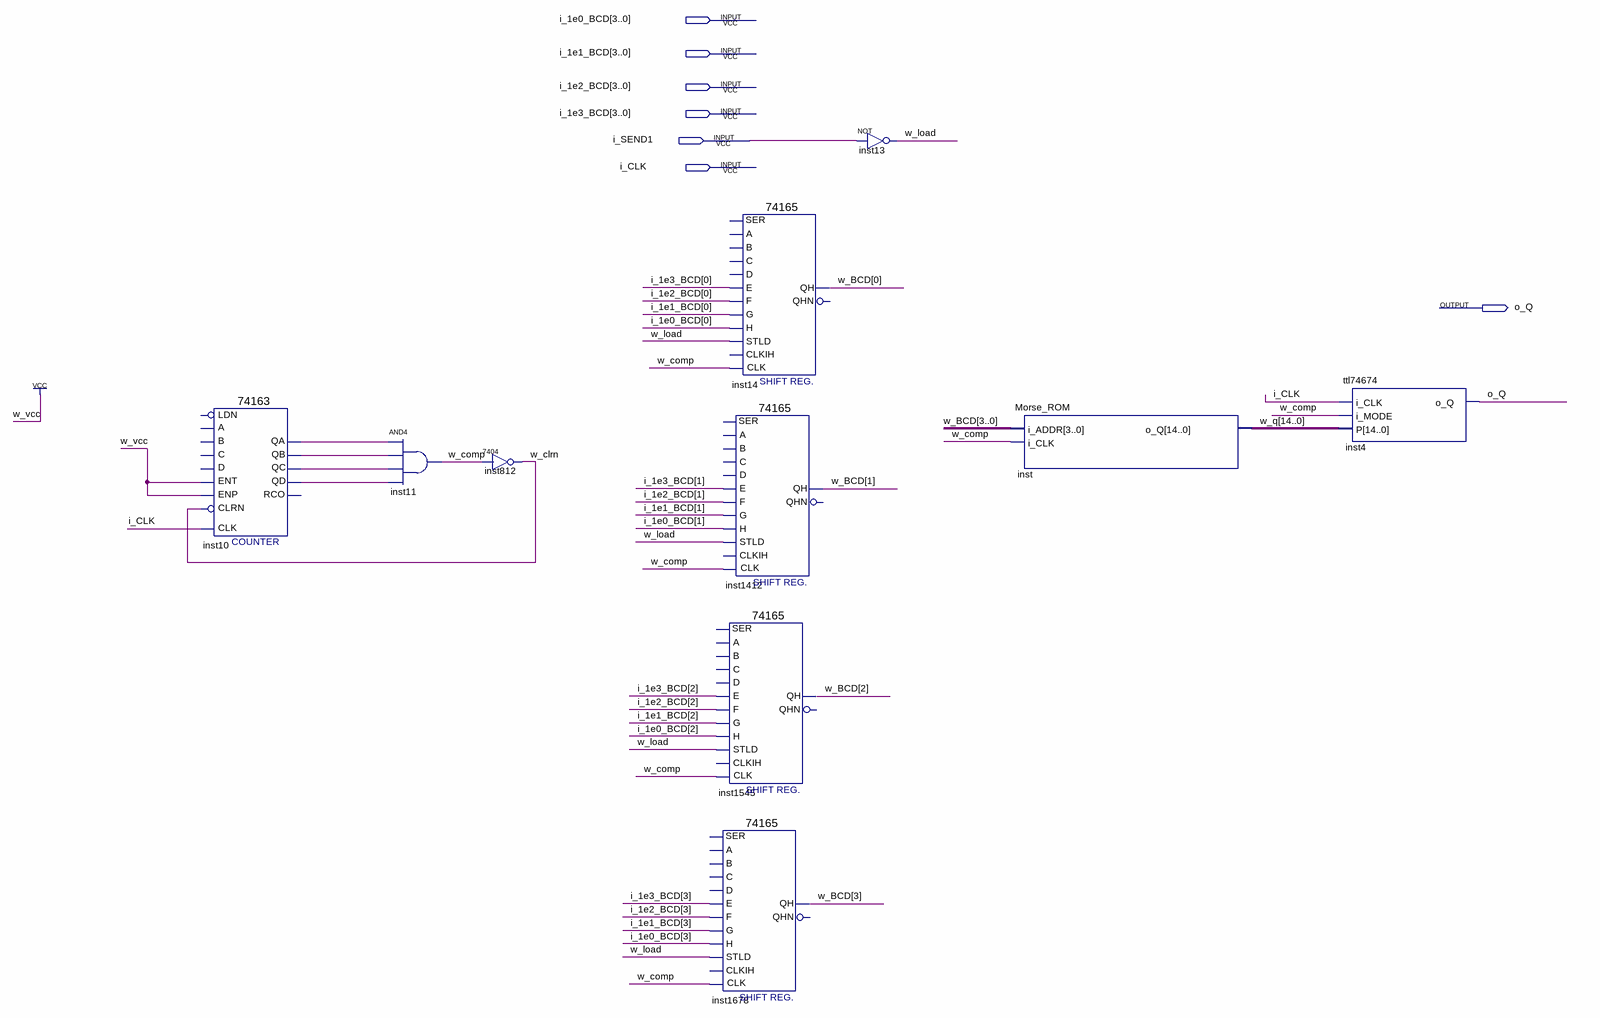
[diagram p0: schematic sheet]
// Quartus schematic sender.bdf as structural Verilog: 10 symbols, 7 pins
module sender (
  input  [3:0] i_1e0_BCD,
  input  [3:0] i_1e1_BCD,
  input  [3:0] i_1e2_BCD,
  input  [3:0] i_1e3_BCD,
  input  i_SEND1,
  input  i_CLK,
  output o_Q
);

  wire inst10_qa, inst10_qb, inst10_qc, inst10_qd, w_clrn, w_comp, w_load;
  wire [3:0] w_BCD;
  wire [14:0] w_q;

  \74163  inst10 (
    .ENT(1'b1), .CLRN(w_clrn), .CLK(i_CLK), .ENP(1'b1), .QA(inst10_qa), .QB(inst10_qb), .QC(inst10_qc),
    .QD(inst10_qd));  // open: C, B, A, D, LDN, RCO
  and inst11 (w_comp, inst10_qa, inst10_qb, inst10_qc, inst10_qd);
  \7404  inst812 (.\2 (w_comp), .\1 (w_clrn));
  \74165  inst14 (
    .G(i_1e1_BCD[0]), .H(i_1e0_BCD[0]), .E(i_1e3_BCD[0]), .F(i_1e2_BCD[0]), .CLK(w_comp), .STLD(w_load),
    .QH(w_BCD[0]));  // open: D, C, B, A, CLKIH, SER, QHN
  \74165  inst1412 (
    .G(i_1e1_BCD[1]), .H(i_1e0_BCD[1]), .E(i_1e3_BCD[1]), .F(i_1e2_BCD[1]), .CLK(w_comp), .STLD(w_load),
    .QH(w_BCD[1]));  // open: D, C, B, A, CLKIH, SER, QHN
  \74165  inst1545 (
    .G(i_1e1_BCD[2]), .H(i_1e0_BCD[2]), .E(i_1e3_BCD[2]), .F(i_1e2_BCD[2]), .CLK(w_comp), .STLD(w_load),
    .QH(w_BCD[2]));  // open: D, C, B, A, CLKIH, SER, QHN
  \74165  inst1678 (
    .G(i_1e1_BCD[3]), .H(i_1e0_BCD[3]), .E(i_1e3_BCD[3]), .F(i_1e2_BCD[3]), .CLK(w_comp), .STLD(w_load),
    .QH(w_BCD[3]));  // open: D, C, B, A, CLKIH, SER, QHN
  not inst13 (w_load, i_SEND1);
  Morse_ROM inst (.i_ADDR(w_BCD), .i_CLK(w_comp), .o_Q(w_q));
  ttl74674 inst4 (.i_CLK(i_CLK), .i_MODE(w_comp), .P(w_q), .o_Q(o_Q));
endmodule
